# EAGLE design mp3thing (EAGLE 5.11)
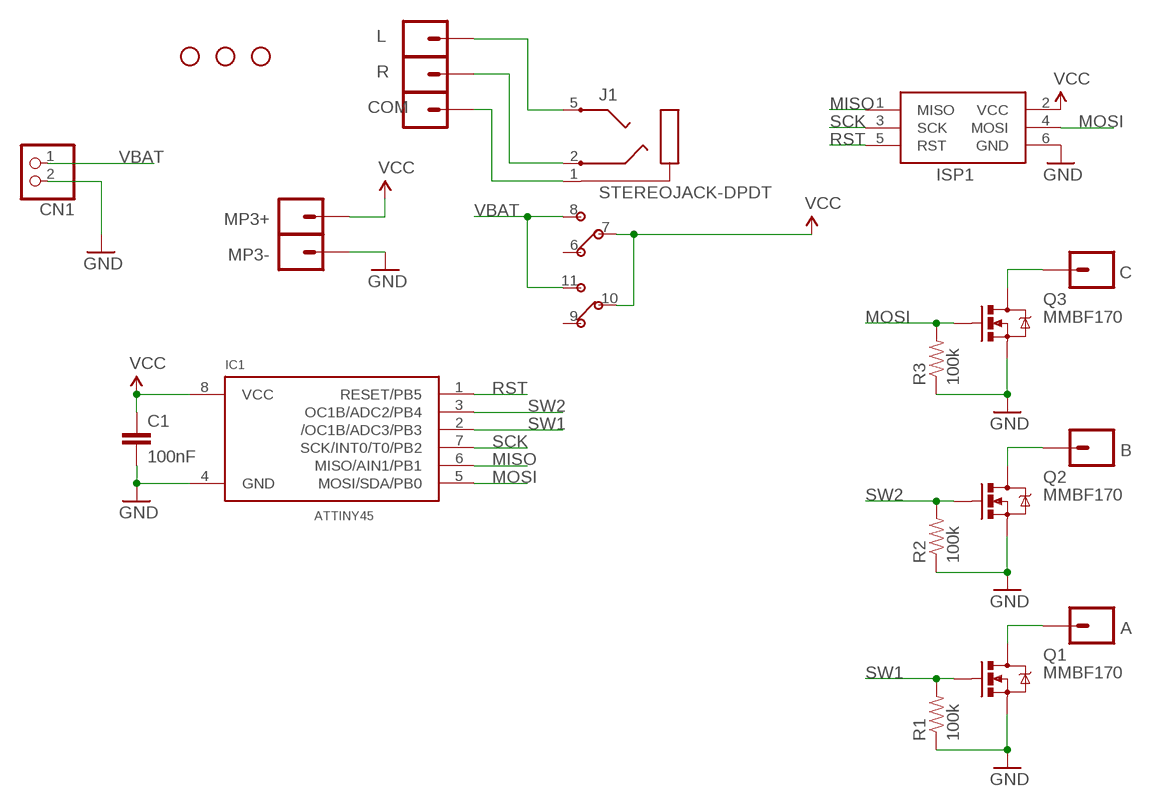
[diagram p0: schematic, sheet 1]

## Parts
A  M01PTH  [1X01]
B  M01PTH  [1X01]
C  M01PTH  [1X01]
C1  100nF  CAP0805  [0805]
CN1  JST_2PIN-SMT-RA  [JST-PH-2-SMT-RA]
COM  M01PTH  [1X01]
IC1  ATTINY45  [SO08-EIAJ]
ISP1  AVRISP-6  [AVRISP]
J1  STEREOJACK-DPDT  [STX3100-9C]
JP1  STAND-OFF  [STAND-OFF]
JP2  STAND-OFF  [STAND-OFF]
JP3  STAND-OFF  [STAND-OFF]
L  M01PTH  [1X01]
MP3+  M01PTH  [1X01]
MP3-  M01PTH  [1X01]
Q1  MMBF170  MOSFET-NCHANNELSMD  [SOT23-3]
Q2  MMBF170  MOSFET-NCHANNELSMD  [SOT23-3]
Q3  MMBF170  MOSFET-NCHANNELSMD  [SOT23-3]
R  M01PTH  [1X01]
R1  100k  RESISTOR0805-RES  [0805]
R2  100k  RESISTOR0805-RES  [0805]
R3  100k  RESISTOR0805-RES  [0805]

## Nets
GND: C1.2 CN1.2 IC1.4(GND) ISP1.6(GND) MP3-.1 Q1.2(S) Q2.2(S) Q3.2(S) R1.1 R2.1 R3.1
MISO: IC1.6(MISO/AIN1/PB1) ISP1.1(MISO)
MOSI: IC1.5(MOSI/SDA/PB0) ISP1.4(MOSI) Q3.1(G) R3.2
N$1: COM.1 J1.1
N$2: B.1 Q2.3(D)
N$4: C.1 Q3.3(D)
N$5: A.1 Q1.3(D)
N$7: J1.5 L.1
N$8: J1.2 R.1
RST: IC1.1(RESET/PB5) ISP1.5(RST)
SCK: IC1.7(SCK/INT0/T0/PB2) ISP1.3(SCK)
SW1: IC1.2(/OC1B/ADC3/PB3) Q1.1(G) R1.2
SW2: IC1.3(OC1B/ADC2/PB4) Q2.1(G) R2.2
VBAT: CN1.1 J1.8 J1.11
VCC: C1.1 IC1.8(VCC) ISP1.2(VCC) J1.7 J1.10 MP3+.1
Unconnected: J1.6 J1.9

## Library data of the parts
A B C COM L MP3+ MP3- R = SparkFun-20110517:M01: Header 1 Standard 1-pin 0.1" header. Use with straight break away headers (SKU : PRT-00116), right angle break away headers (PRT-00553), swiss pins (PRT-00743), machine pins (PRT-00117), and female headers (PRT-00115).
C1 = SparkFun-20110511:CAP: Capacitor Standard 0603 ceramic capacitor, and 0.1" leaded capacitor.
CN1 = adafruit-20120122:JST_2PIN: JST 2-Pin Connectors of various flavors SMT-RA (S2B-PH-SM4) 4UConnector #17311 SMT (B2B-PH-SM4) THM-RA (S2B-PH) THM (B2B-PH)
IC1 = todstuff:ATTINY45
ISP1 = adafruit-20120122:AVRISP: AVR ISP HEADER Standard 6 pin header for AVR programming
J1 = todstuff:STEREOJACK-DPDT
JP1-JP3 = SparkFun-20110517:STAND-OFF: Stand Off This is the mechanical footprint for a #4 phillips button head screw. Use the keepout ring to avoid running the screw head into surrounding components. SKU : PRT-00447
Q1-Q3 = SparkFun-20110517:MOSFET-NCHANNEL
R1-R3 = SparkFun-20110517:RESISTOR: Resistor Basic schematic elements and footprints for 0603, 1206, and PTH resistors.

## Board
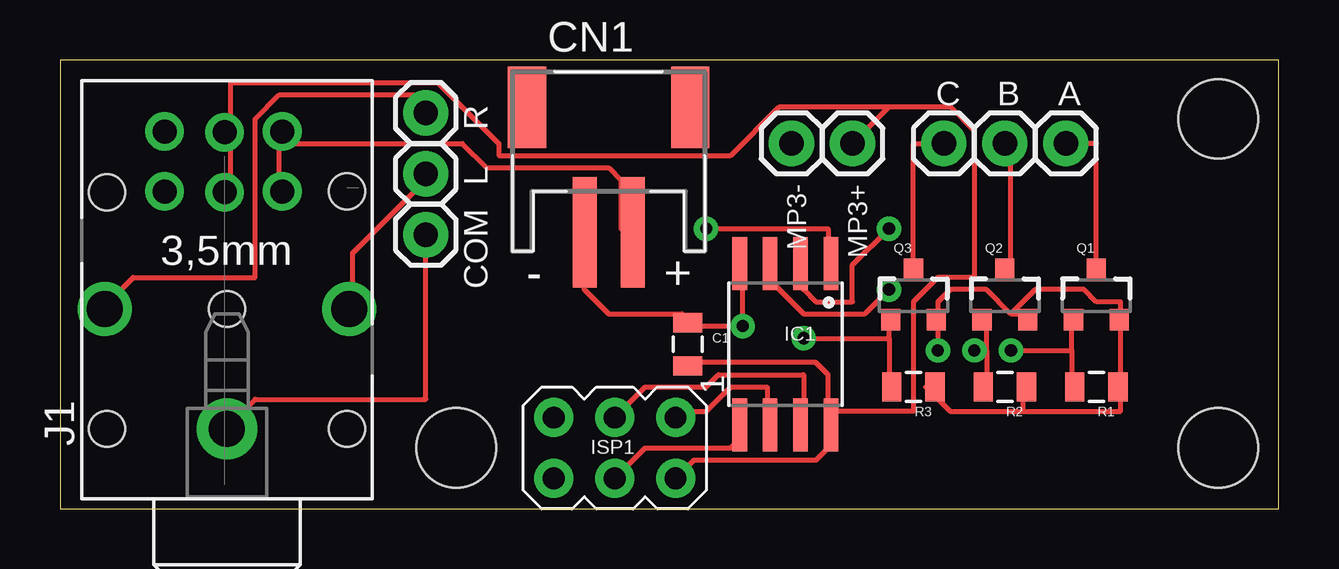
[diagram p1: board, top side]
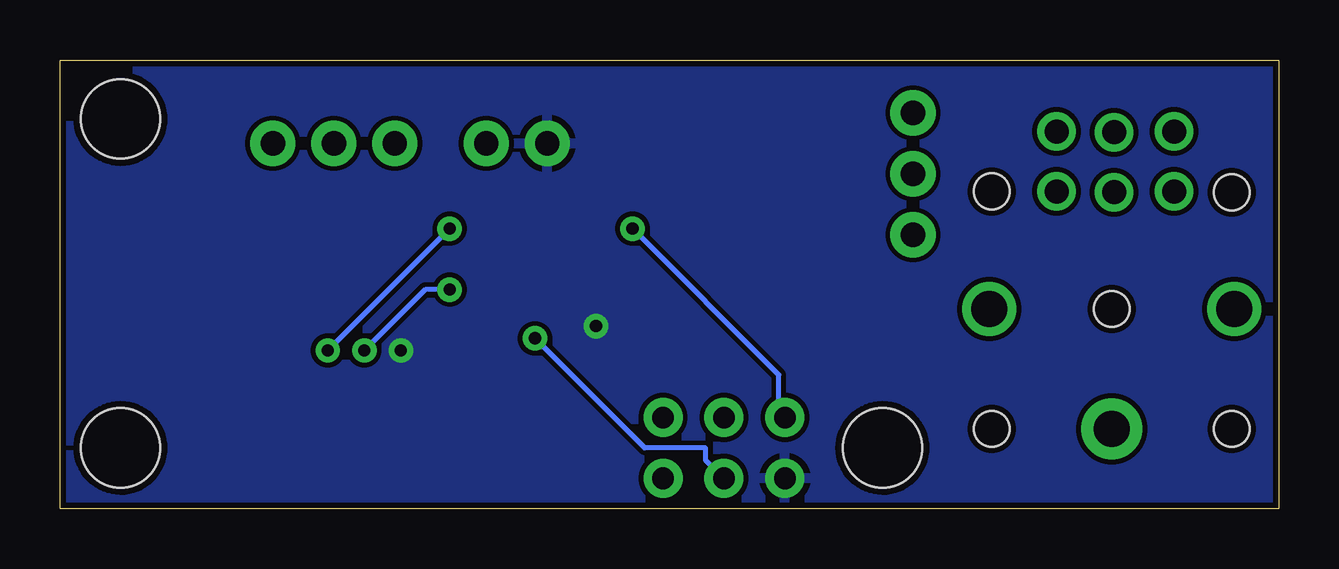
[diagram p2: board, bottom side, seen from below]

Size 50.78 x 18.72 mm. Coordinates in mm from the lower left corner, seen from the top.
Outline: 0,0 50.78,0 50.78,18.72 0,18.72 0,0
Copper layers (1*16): Top 0.035mm / dielectric 1.5mm / Bottom 0.035mm
Design rules "SparkFun": minimum track width 8mil, minimum drill 20mil, track to track 8mil, track to pad 8mil, pad to pad 8mil, via to via 8mil, smd to smd 8mil, copper to edge 10mil, drill to drill 8mil, minimum pad ring 12mil, minimum via ring 10mil, stop-mask expansion 4mil, vias tented up to drill 25mil, thermal gap 10mil

### Footprints (pad centres in the part's own frame; a part is rotated, then mirrored left to right if it is on the bottom)
1X01 = drill 1.016 pad 1.88 round: 1 0,0
0805 = smd 0.8 x 1.2: 1 -0.9,0; 2 0.9,0
JST-PH-2-SMT-RA = smd 1 x 4.6: 1 1,-3.7; 2 -1,-3.7 | smd 1.6 x 3.4: NC1 -3.4,1.5; NC2 3.4,1.5
SO08-EIAJ = smd 0.61 x 2.21: 1 -1.905,-3.378; 2 -0.635,-3.378; 3 0.635,-3.378; 4 1.905,-3.378; 5 1.905,3.353; 6 0.635,3.353; 7 -0.635,3.353; 8 -1.905,3.353
AVRISP = drill 0.9 pad 1.626 round: 1 -1.27,2.54; 2 1.27,2.54; 3 -1.27,0; 4 1.27,0; 5 -1.27,-2.54; 6 1.27,-2.54
STX3100-9C = drill 1.5 pad 2.54 round: 1 1.43,-0.1 | drill 1.5 round: 2 6.43,5; 5 6.43,-5.2 | drill 1 round: 6 11.33,2.5; 7 11.3,0; 8 11.33,-2.4; 9 13.83,2.5; 10 13.8,0; 11 13.83,-2.4 | hole 1.5: 1.43,4.9; 1.43,-5.1; 6.43,-0.1; 11.295,4.9; 11.33,-5.1
STAND-OFF = hole 3.302: 0,0
SOT23-3 = smd 0.8 x 0.9: 1 -0.95,-1; 2 0.95,-1; 3 0,1.1

### Placement (x,y rotation side)
A  41.91,15.24 0 top
B  39.37,15.24 0 top
C  36.83,15.24 0 top
C1  26.16,6.86 90 top
CN1  22.86,15.24 0 top
COM  15.24,11.43 270 top
IC1  30.23,6.86 180 top
ISP1  23.11,2.54 270 top
J1  6.86,1.91 90 top
JP1  16.51,2.54 0 top
JP2  48.26,16.26 0 top
JP3  48.26,2.54 0 top
L  15.24,13.97 270 top
MP3+  33.02,15.24 0 top
MP3-  30.48,15.24 0 top
Q1  43.18,8.89 0 top
Q2  39.37,8.89 0 top
Q3  35.56,8.89 0 top
R  15.24,16.51 270 top
R1  43.18,5.08 180 top
R2  39.37,5.08 180 top
R3  35.56,5.08 180 top

### Tracks (layer width: path | path; a pad name or v marks a point on that pad's centre or on a via)
GND  (via drill 0.51)
  Top 0.203: 39.62,8.13 40.13,8.13 Q2.2 | 39.62,8.13 38.61,9.14 37.08,9.14 36.58,8.64 36.58,8.13 Q3.2 36.58,7.62 v36.58,6.6 | 39.62,8.13 40.64,9.14 42.67,9.14 43.18,8.64 44.2,8.64 44.2,8.13 Q1.2 44.2,7.62 44.2,5.08 | 40.13,4.06 40.13,5.08 R2.1 | 40.13,4.06 37.08,4.06 36.07,5.08 R3.1 | 44.2,5.08 44.2,4.06 40.13,4.06 | 44.2,5.08 R1.1 44.2,5.08 | IC1.4 28.45,10.16 v28.45,7.62 26.42,7.62 C1.2 25.91,8.13 22.86,8.13 21.84,9.14 21.84,11.18 CN1.2
  pour Bottom: 0,22.86 0,-1.27 53.34,-1.27 52.07,22.86
MISO
  Top 0.203: IC1.6 29.46,3.56 29.46,5.08 27.94,5.08 26.92,4.06 25.91,4.06 ISP1.1
MOSI  (via drill 0.51)
  Top 0.203: 34.54,7.11 34.54,5.08 R3.2 | 34.54,7.11 34.54,7.62 Q3.1 | v30.99,7.11 34.54,7.11 | IC1.5 28.45,3.05 27.94,2.54 24.38,2.54 23.37,1.52 ISP1.4
  Bottom 0.203: v30.99,7.11 26.42,2.54 23.88,2.54 23.88,2.03 23.37,1.52 ISP1.4
N$1
  Top 0.203: COM.1 15.24,11.18 15.24,4.57 8.13,4.57 7.11,3.56 J1.1
N$2
  Top 0.203: Q2.3 39.62,10.16 39.62,15.24 B.1
N$4
  Top 0.203: Q3.3 35.56,10.16 35.56,15.24 36.58,15.24 C.1
N$5
  Top 0.203: Q1.3 43.18,10.16 43.18,15.24 42.16,15.24 A.1
N$7
  Top 0.203: L.1 15.24,13.72 12.19,10.67 12.19,8.64 J1.5
N$8
  Top 0.203: R.1 15.24,16.76 14.73,17.27 9.14,17.27 8.13,16.26 8.13,9.65 3.05,9.65 2.03,8.64 J1.2
RST  (via drill 0.51)
  Top 0.203: v26.92,11.68 32,11.68 32,10.67 IC1.1
  Bottom 0.203: v26.92,11.68 20.83,5.59 20.83,4.06 ISP1.5
SCK
  Top 0.203: IC1.7 30.99,3.56 30.99,5.59 27.43,5.59 26.92,5.08 24.38,5.08 23.37,4.06 ISP1.3
SW1  (via drill 0.51)
  Top 0.203: 42.16,6.6 42.16,5.08 R1.2 | 42.16,6.6 42.16,7.62 Q1.1 | v39.62,6.6 42.16,6.6 | v34.54,11.68 33.02,10.16 33.02,8.64 31.5,8.64 30.99,9.14 30.99,10.16 IC1.2
  Bottom 0.203: v34.54,11.68 v39.62,6.6
SW2  (via drill 0.51)
  Top 0.203: 38.61,6.6 38.61,5.08 R2.2 | 38.61,6.6 38.61,7.62 Q2.1 | v38.1,6.6 38.61,6.6 | v34.54,9.14 33.53,8.13 30.99,8.13 29.46,9.65 29.46,10.16 IC1.3
  Bottom 0.203: v38.1,6.6 35.56,9.14 v34.54,9.14
VBAT
  Top 0.203: J1.8 9.14,13.72 9.14,15.24 J1.11 9.65,15.24 16.76,15.24 17.78,14.22 22.86,14.22 23.37,13.72 23.37,11.68 CN1.1
VCC
  Top 0.203: J1.7 7.11,13.21 7.11,15.24 J1.10 7.11,15.75 7.11,17.78 15.75,17.78 18.29,15.24 18.29,14.73 27.94,14.73 29.97,16.76 34.54,16.76 | 32,4.06 32,3.56 IC1.8 | 32,4.06 32,5.59 31.5,6.1 26.42,6.1 C1.1 | ISP1.2 25.91,1.52 26.42,2.03 31.5,2.03 32,2.54 32,3.05 IC1.8 | 34.54,16.76 MP3+.1 | 34.54,16.76 37.08,16.76 38.1,15.75 38.1,9.65 36.58,9.65 35.56,8.64 35.56,4.06 32,4.06 | 32,4.06 IC1.8